# EAGLE design OsmoPod3.0 (EAGLE 9.6.2)
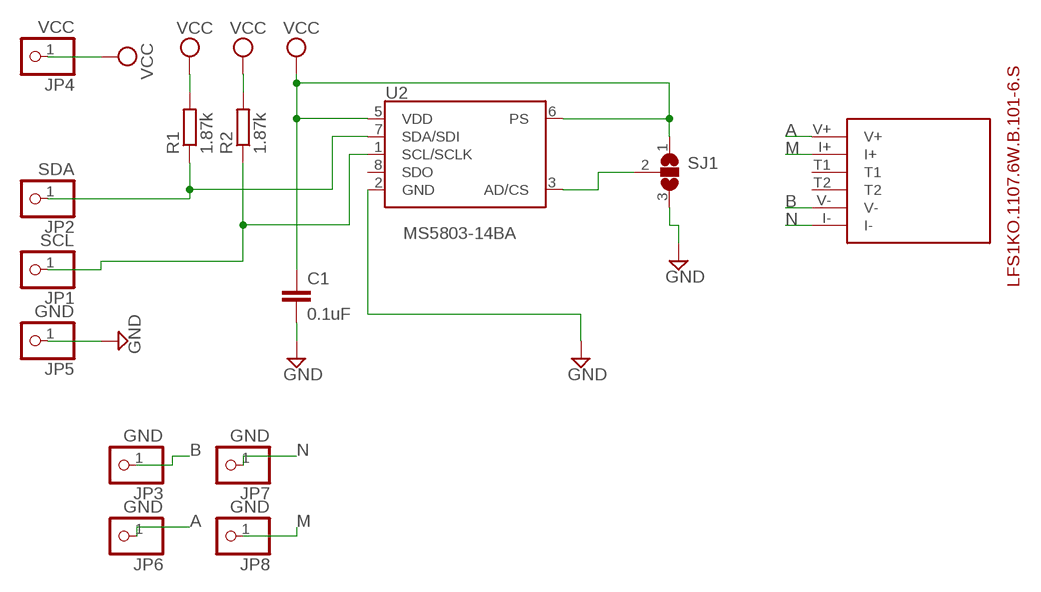
[diagram p0: schematic, sheet 1]

## Parts
C1  0.1uF  C-EUC0805  [C0805]
JP1  SCL  PINHD-1X1  [1X01]
JP2  SDA  PINHD-1X1  [1X01]
JP3  GND  PINHD-1X1  [1X01]
JP4  VCC  PINHD-1X1  [1X01]
JP5  GND  PINHD-1X1  [1X01]
JP6  GND  PINHD-1X1  [1X01]
JP7  GND  PINHD-1X1  [1X01]
JP8  GND  PINHD-1X1  [1X01]
R1  1.87k  R-EU_R0805  [R0805]
R2  1.87k  R-EU_R0805  [R0805]
SJ1  SJ2W  [SJ_2]
U2  MS5803-14BA  [MS5803]
U$1  LFS1107_6W  [LFS1107_6W]

## Nets
A: JP6.1 U$1.V+
B: JP3.1 U$1.V-
CSB: SJ1.2 U2.3(AD/CS)
GND: C1.2 JP5.1 SJ1.3 U2.2(GND)
M: JP8.1 U$1.I+
N: JP7.1 U$1.I-
SCL: JP1.1 R2.1 U2.1(SCL/SCLK)
SDA: JP2.1 R1.1 U2.7(SDA/SDI)
VCC: C1.1 JP4.1 R1.2 R2.2 SJ1.1 U2.5(VDD) U2.6(PS)
Unconnected: U2.8(SDO) U$1.T1 U$1.T2

## Library data of the parts
C1 = rcl:C-EU: CAPACITOR, European symbol; SPICEPREFIX: C
JP1-JP8 = pinhead_simple:PINHD-1X1: PIN HEADER
R1 R2 = rcl:R-EU_: RESISTOR, European symbol; SPICEPREFIX: R
SJ1 = jumper:SJ2W: SMD solder JUMPER
U2 = SparkFun-Sensors:MS5803-14BA: Measurement Specialties MS5803_14BA Pressure (Depth) Sensor The MS5803-14BA is a new generation of high resolution pressure sensors with SPI and I2C bus interface. It is optimized for depth measurement systems with a water depth resolution of 1cm and below. The sensor module includes a high linear pressure sensor and an ultra low power 24 bit ΔΣ ADC with internal factory calibrated coefficients. It provides a precise digital 24 Bit pressure and temperature value and different operation modes that allow the user to optimize for conversion speed and current consumption. Datasheet <https://cdn.sparkfun.com/datasheets/Sensors/Weather/ms5803_14ba.pdf> SparkFun Products SparkFun Pressure Sensor Breakout - MS5803-14BA <https://www.sparkfun.com/products/12909> (SEN-12909); PROD_ID: IC-12111
U$1 = LF1107:LFS1107_6W

## Board
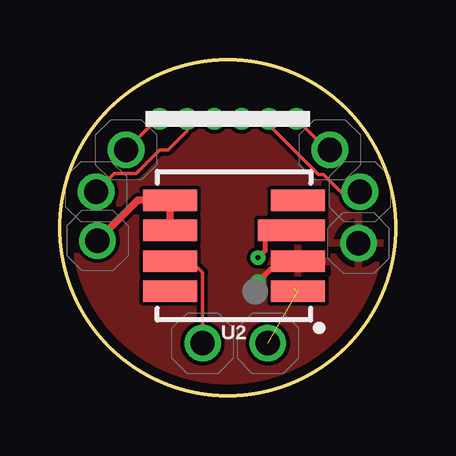
[diagram p1: board, top side]
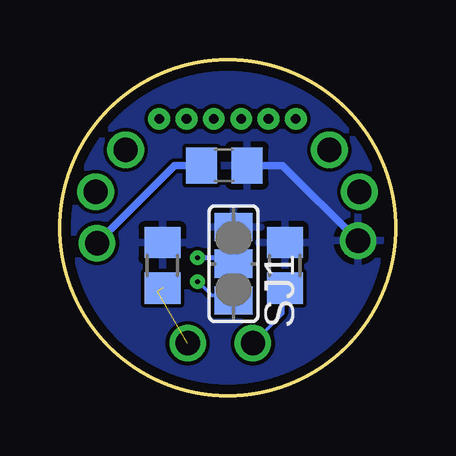
[diagram p2: board, bottom side, seen from below]

Size 14 x 14 mm. Coordinates in mm from the lower left corner, seen from the top.
Outline: circle at 7,7 radius 7
Copper layers (1*16): Top 0.035mm / dielectric 1.5mm / Bottom 0.035mm
Design rules "default *": minimum track width 6mil, minimum drill 0.35mm, track to track 6mil, track to pad 6mil, pad to pad 6mil, via to via 6mil, smd to smd 6mil, copper to edge 15mil, drill to drill 6mil, minimum pad ring 10mil, minimum via ring 8mil, stop-mask expansion 4mil, vias tented up to drill 0mil, thermal gap 10mil

### Footprints (pad centres in the part's own frame; a part is rotated, then mirrored left to right if it is on the bottom)
C0805 = smd 1.3 x 1.5: 1 -0.95,0; 2 0.95,0
1X01 = drill 1.016: 1 0,0
R0805 = smd 1.3 x 1.5: 1 -0.95,0; 2 0.95,0
SJ_2 = smd 1.168 x 1.6: 1 -1.524,0; 2 0,0; 3 1.524,0
MS5803 = smd 2.25 x 0.9: 1 -2.675,1.9; 2 -2.675,0.65; 4 -2.675,-1.9; 5 2.675,-1.9; 6 2.675,-0.65; 7 2.675,0.65; 8 2.675,1.9 | smd 2.8 x 0.9: 3 -2.4,-0.65
LFS1107_6W = drill 0.4 pad 0.606: I+ 1.14,0; I- 4.56,0; T1 2.28,0; T2 3.42,0; V+ 0,0; V- 5.7,0

### Placement (x,y rotation side)
C1  7.15,9.6 180 bottom
JP1  8.67,2.18 0 top
JP2  5.95,2.18 0 top
JP3  2.76,10.25 0 top
JP4  1.57,6.46 0 top
JP5  12.45,6.36 0 top
JP6  11.26,10.25 0 top
JP7  1.51,8.5 0 top
JP8  12.51,8.5 0 top
R1  4.62,5.43 90 bottom
R2  9.72,5.43 90 bottom
SJ1  6.76,5.5 270 bottom
U2  7.26,6.25 180 top
U$1  9.86,11.54 180 top

### Tracks (layer width: path | path; a pad name or v marks a point on that pad's centre or on a via)
A
  Top 0.152: JP6.1 11.15,10.25 U$1.V+
B
  Top 0.152: JP3.1 4.05,11.54 U$1.V-
CSB  (via drill 0.2)
  Top 0.2: U2.3 8.91,6.9 8.81,6.8 8.56,6.8 8.56,6.05 v8.26,5.75
  Bottom 0.2: v8.26,5.75 7.01,5.75 SJ1.2
GND  (via drill 0.2)
  Top 0.2: v8.26,4.75 9.11,5.6 U2.2
  Bottom 0.152: SJ1.3 6.97,4.19 7.65,4.19 8.22,4.75 v8.26,4.75
  Bottom 0.305: JP5.1 9.21,9.6 C1.2
  pour Top: -1.24,12.25 -1.24,1.25 1.76,-1.75 12.76,-1.75 15.76,1.25 15.76,13.25 12.76,16.25 1.76,16.25 -1.24,13.25
M
  Top 0.152: JP8.1 11.72,8.5 10.99,9.23 10.78,9.23 8.72,11.29 U$1.I+
N
  Top 0.152: JP7.1 2.27,9.26 3.17,9.26 4.16,10.25 4.51,10.25 5.3,11.04 U$1.I-
SCL  (2 unrouted)
SDA
  Top 0.152: JP2.1 5.95,5.13 5.55,5.53 4.66,5.53 U2.7
  Bottom 0.152: R1.1 4.7,4.4 4.7,3.43 JP2.1
VCC
  Top 0.305: JP4.1 3.26,8.15 U2.5 U2.6
  Bottom 0.305: JP4.1 4.71,9.6 C1.1
  pour Bottom: -1.24,13.25 -1.24,1.25 1.76,-1.75 12.76,-1.75 15.76,1.25 15.76,13.25 12.76,16.25 1.76,16.25